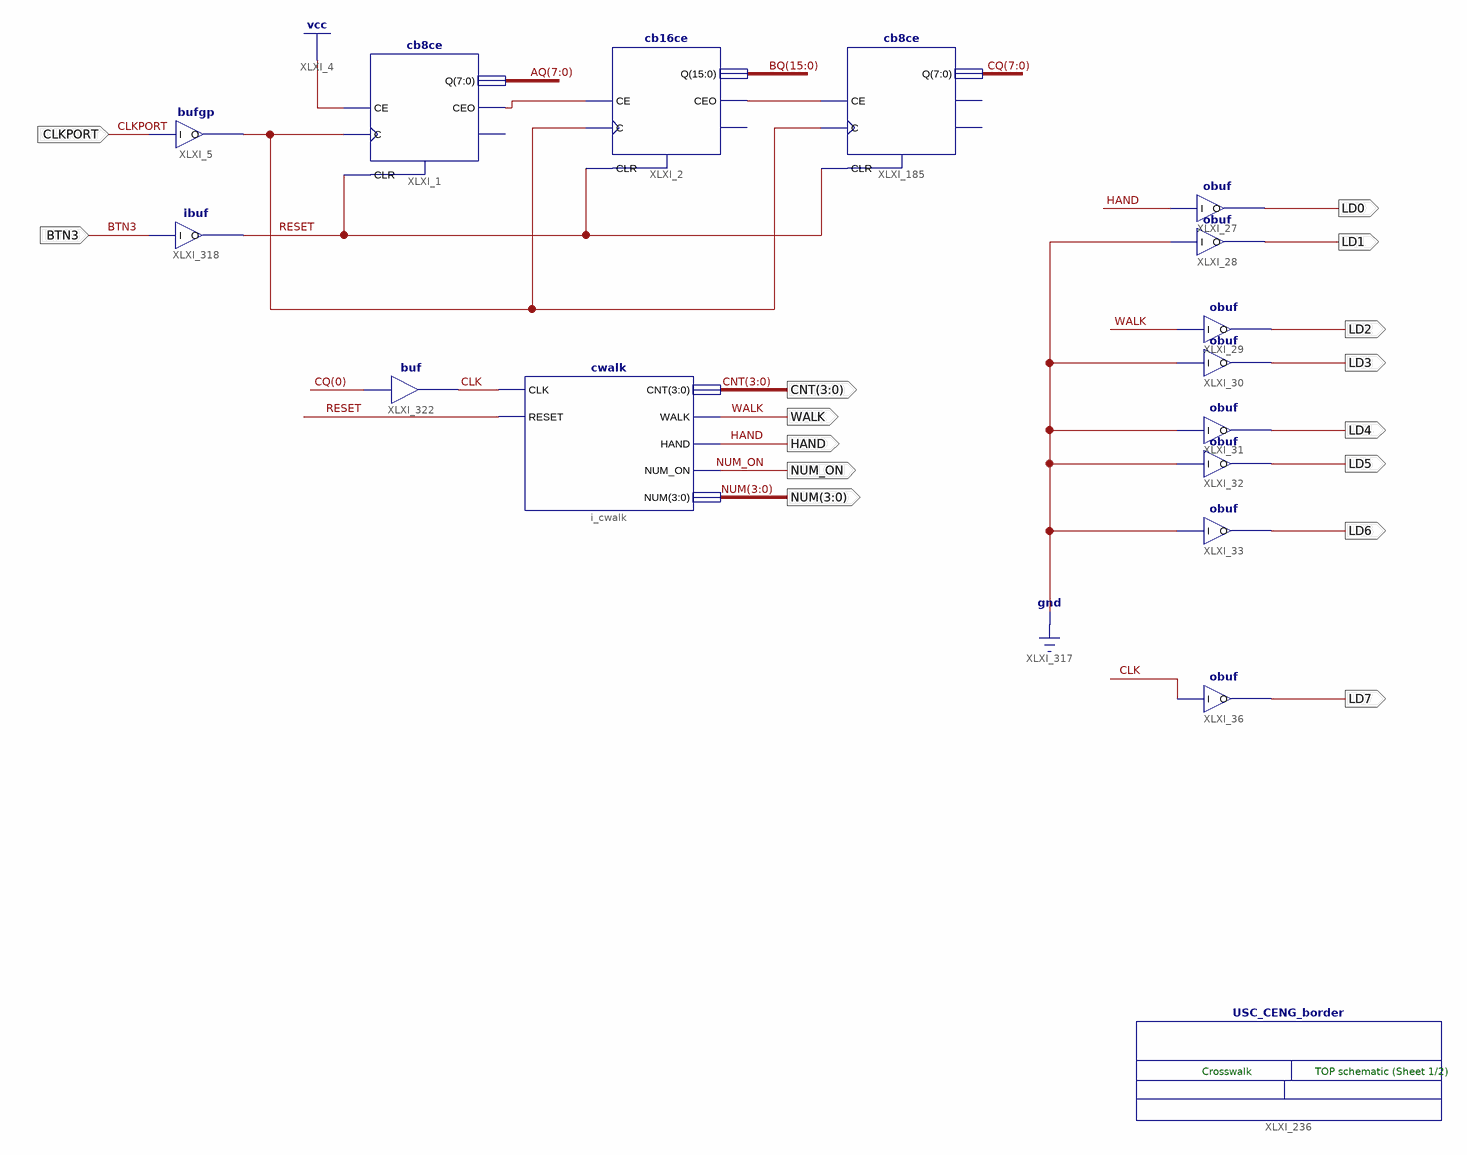
[diagram p0: schematic sheet 1]
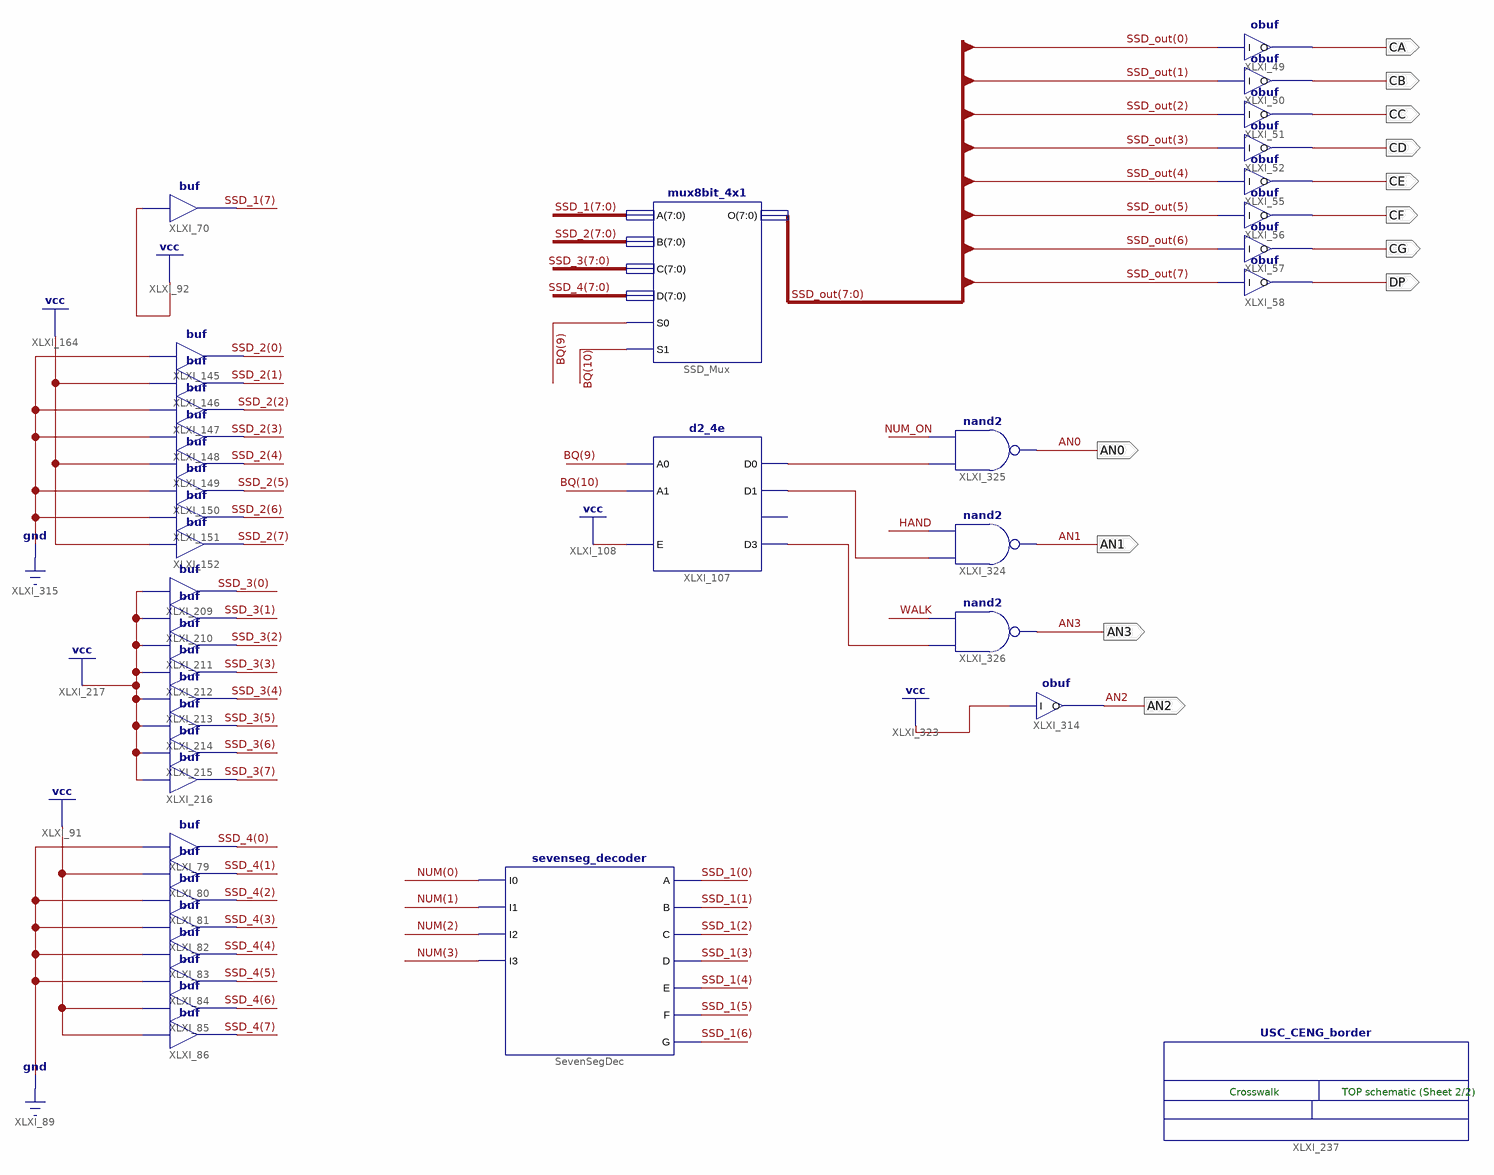
[diagram p1: schematic sheet 2]
// Xilinx ISE schematic cwalk_top.sch (spartan3e) as structural Verilog: 57 symbols, 27 ports
module cwalk_top (
  input  CLKPORT,
  input  BTN3,
  output CA,
  output CB,
  output CC,
  output CD,
  output CE,
  output CF,
  output CG,
  output DP,
  output LD1,
  output LD0,
  output LD4,
  output LD5,
  output LD6,
  output LD3,
  output LD2,
  output LD7,
  output [3:0] CNT,
  output WALK,
  output HAND,
  output NUM_ON,
  output [3:0] NUM,
  output AN0,
  output AN1,
  output AN3,
  output AN2
);

  wire CLK, CLK_port, RESET, XLXN_1, XLXN_522, XLXN_745, XLXN_747, XLXN_753;
  wire [7:0] AQ, CQ, SSD_1, SSD_2, SSD_3, SSD_4, SSD_out;
  wire [15:0] BQ;

  obuf XLXI_49 (.I(SSD_out[0]), .O(CA));
  obuf XLXI_50 (.I(SSD_out[1]), .O(CB));
  obuf XLXI_51 (.I(SSD_out[2]), .O(CC));
  obuf XLXI_52 (.I(SSD_out[3]), .O(CD));
  obuf XLXI_55 (.I(SSD_out[4]), .O(CE));
  obuf XLXI_56 (.I(SSD_out[5]), .O(CF));
  obuf XLXI_57 (.I(SSD_out[6]), .O(CG));
  obuf XLXI_58 (.I(SSD_out[7]), .O(DP));
  mux8bit_4x1 SSD_Mux (.A(SSD_1), .B(SSD_2), .C(SSD_3), .D(SSD_4), .O(SSD_out), .S0(BQ[9]), .S1(BQ[10]));
  d2_4e XLXI_107 (.A0(BQ[9]), .A1(BQ[10]), .E(1'b1), .D0(XLXN_745), .D1(XLXN_753), .D3(XLXN_747));  // open: D2
  cb8ce XLXI_1 (.C(CLK_port), .CE(1'b1), .CLR(RESET), .CEO(XLXN_1), .Q(AQ));  // open: TC
  bufgp XLXI_5 (.I(CLKPORT), .O(CLK_port));
  cb8ce XLXI_185 (.C(CLK_port), .CE(XLXN_522), .CLR(RESET), .Q(CQ));  // open: CEO, TC
  cb16ce XLXI_2 (.C(CLK_port), .CE(XLXN_1), .CLR(RESET), .CEO(XLXN_522), .Q(BQ));  // open: TC
  obuf XLXI_28 (.I(1'b0), .O(LD1));
  obuf XLXI_27 (.I(HAND), .O(LD0));
  obuf XLXI_31 (.I(1'b0), .O(LD4));
  obuf XLXI_32 (.I(1'b0), .O(LD5));
  obuf XLXI_33 (.I(1'b0), .O(LD6));
  obuf XLXI_30 (.I(1'b0), .O(LD3));
  obuf XLXI_29 (.I(WALK), .O(LD2));
  obuf XLXI_36 (.I(CLK), .O(LD7));
  USC_CENG_border XLXI_236 ();
  USC_CENG_border XLXI_237 ();
  buf XLXI_70 (SSD_1[7], 1'b1);
  buf XLXI_145 (SSD_2[0], 1'b0);
  buf XLXI_146 (SSD_2[1], 1'b1);
  buf XLXI_147 (SSD_2[2], 1'b0);
  buf XLXI_148 (SSD_2[3], 1'b0);
  buf XLXI_149 (SSD_2[4], 1'b1);
  buf XLXI_150 (SSD_2[5], 1'b0);
  buf XLXI_151 (SSD_2[6], 1'b0);
  buf XLXI_152 (SSD_2[7], 1'b1);
  buf XLXI_209 (SSD_3[0], 1'b1);
  buf XLXI_210 (SSD_3[1], 1'b1);
  buf XLXI_211 (SSD_3[2], 1'b1);
  buf XLXI_212 (SSD_3[3], 1'b1);
  buf XLXI_213 (SSD_3[4], 1'b1);
  buf XLXI_214 (SSD_3[5], 1'b1);
  buf XLXI_215 (SSD_3[6], 1'b1);
  buf XLXI_216 (SSD_3[7], 1'b1);
  buf XLXI_79 (SSD_4[0], 1'b0);
  buf XLXI_80 (SSD_4[1], 1'b1);
  buf XLXI_81 (SSD_4[2], 1'b0);
  buf XLXI_82 (SSD_4[3], 1'b0);
  buf XLXI_83 (SSD_4[4], 1'b0);
  buf XLXI_84 (SSD_4[5], 1'b0);
  buf XLXI_85 (SSD_4[6], 1'b1);
  buf XLXI_86 (SSD_4[7], 1'b1);
  sevenseg_decoder SevenSegDec (
    .I0(NUM[0]), .I1(NUM[1]), .I2(NUM[2]), .I3(NUM[3]), .A(SSD_1[0]), .B(SSD_1[1]), .C(SSD_1[2]),
    .E(SSD_1[4]), .D(SSD_1[3]), .F(SSD_1[5]), .G(SSD_1[6]));
  obuf XLXI_314 (.I(1'b1), .O(AN2));
  ibuf XLXI_318 (.I(BTN3), .O(RESET));
  buf XLXI_322 (CLK, CQ[0]);
  nand XLXI_324 (AN1, XLXN_753, HAND);
  nand XLXI_325 (AN0, XLXN_745, NUM_ON);
  nand XLXI_326 (AN3, XLXN_747, WALK);
  cwalk i_cwalk (.CLK(CLK), .CNT(CNT), .HAND(HAND), .NUM(NUM), .NUM_ON(NUM_ON), .RESET(RESET), .WALK(WALK));

  // Notes on the sheet:
  //   Crosswalk
  //   TOP schematic (Sheet 1/2)
  //   Crosswalk
  //   TOP schematic (Sheet 2/2)
endmodule
